# EAGLE design Blunderwood_LED_Driver (EAGLE 7.3.0)
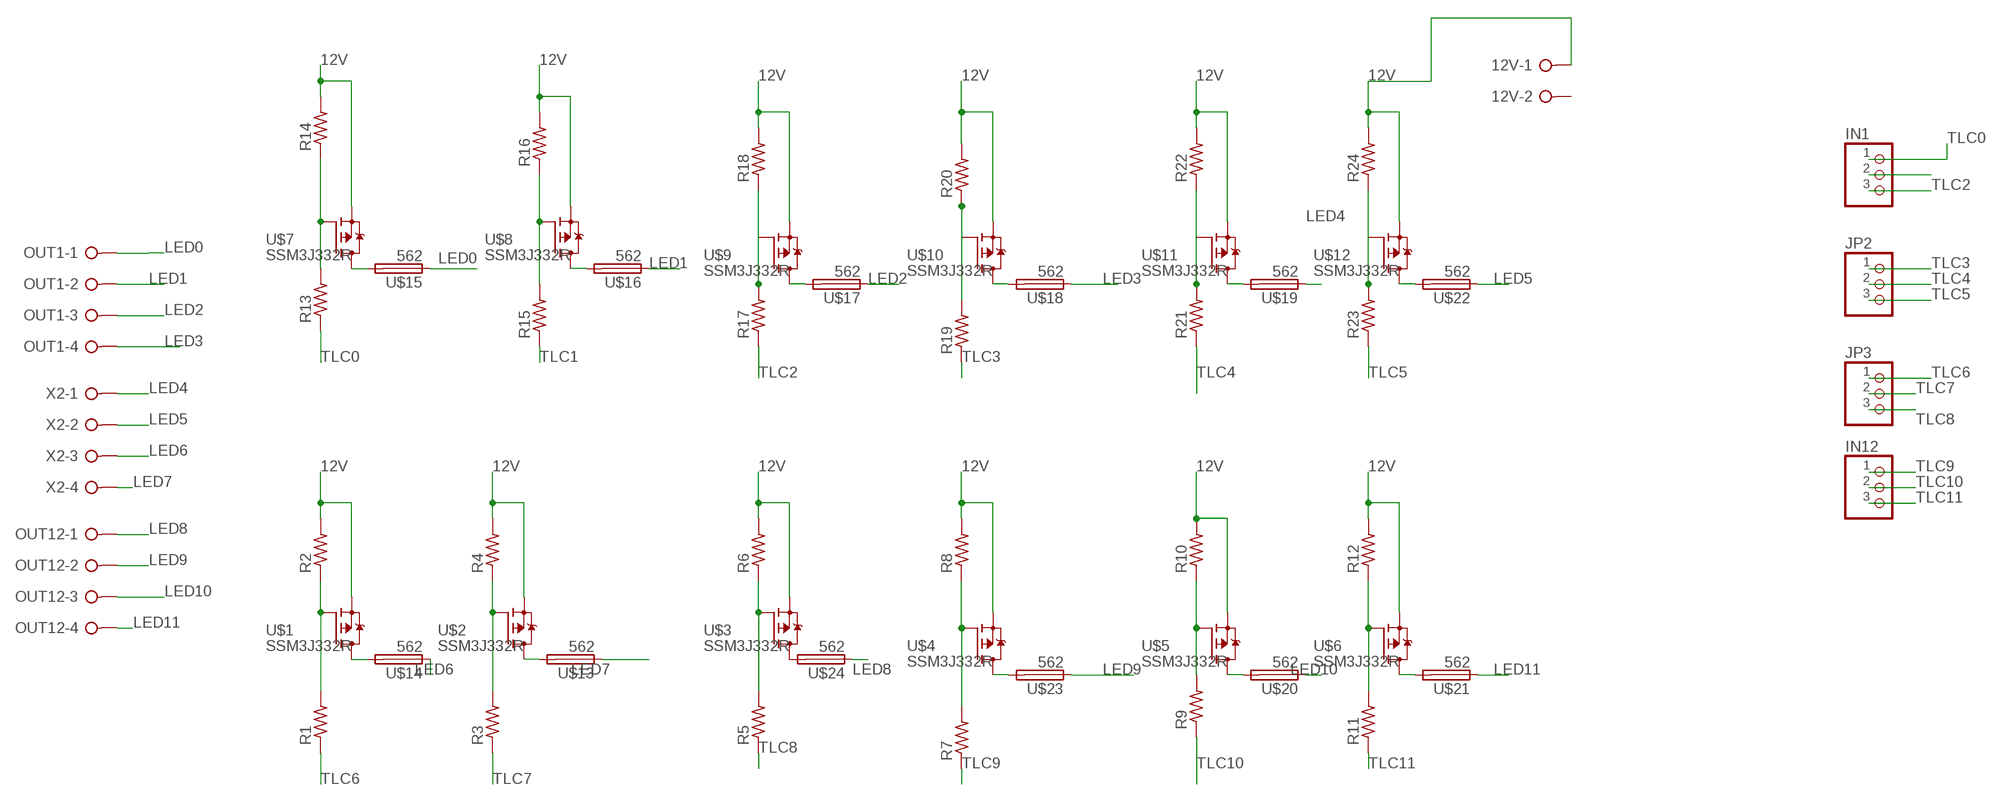
[diagram p0: schematic, sheet 1]

## Parts
12V  W237-02P  [W237-132]
IN1  PINHD-1X3  [1X03]
IN12  PINHD-1X3  [1X03]
JP2  PINHD-1X3  [1X03]
JP3  PINHD-1X3  [1X03]
OUT1  W237-04P  [W237-4P]
OUT12  W237-04P  [W237-4P]
R1  R-US_R0805  [R0805]
R2  R-US_R0805  [R0805]
R3  R-US_R0805  [R0805]
R4  R-US_R0805  [R0805]
R5  R-US_R0805  [R0805]
R6  R-US_R0805  [R0805]
R7  R-US_R0805  [R0805]
R8  R-US_R0805  [R0805]
R9  R-US_R0805  [R0805]
R10  R-US_R0805  [R0805]
R11  R-US_R0805  [R0805]
R12  R-US_R0805  [R0805]
R13  R-US_R0805  [R0805]
R14  R-US_R0805  [R0805]
R15  R-US_R0805  [R0805]
R16  R-US_R0805  [R0805]
R17  R-US_R0805  [R0805]
R18  R-US_R0805  [R0805]
R19  R-US_R0805  [R0805]
R20  R-US_R0805  [R0805]
R21  R-US_R0805  [R0805]
R22  R-US_R0805  [R0805]
R23  R-US_R0805  [R0805]
R24  R-US_R0805  [R0805]
U$1  SSM3J332R  [SOT23]
U$2  SSM3J332R  [SOT23]
U$3  SSM3J332R  [SOT23]
U$4  SSM3J332R  [SOT23]
U$5  SSM3J332R  [SOT23]
U$6  SSM3J332R  [SOT23]
U$7  SSM3J332R  [SOT23]
U$8  SSM3J332R  [SOT23]
U$9  SSM3J332R  [SOT23]
U$10  SSM3J332R  [SOT23]
U$11  SSM3J332R  [SOT23]
U$12  SSM3J332R  [SOT23]
U$13  562  [564]
U$14  562  [564]
U$15  562  [564]
U$16  562  [564]
U$17  562  [564]
U$18  562  [564]
U$19  562  [564]
U$20  562  [564]
U$21  562  [564]
U$22  562  [564]
U$23  562  [564]
U$24  562  [564]
X2  W237-04P  [W237-4P]

## Nets
12V: 12V.1 R2.2 R4.2 R6.2 R8.2 R10.2 R12.2 R14.2 R16.2 R18.2 R20.2 R22.2 R24.2 U$1.2(S) U$2.2(S) U$3.2(S) U$4.2(S) U$5.2(S) U$6.2(S) U$7.2(S) U$8.2(S) U$9.2(S) U$10.2(S) U$11.2(S) U$12.2(S)
LED0: OUT1.1 U$15.P$3
LED1: OUT1.2 U$16.P$3
LED2: OUT1.3 U$17.P$3
LED3: OUT1.4 U$18.P$3
LED4: U$19.P$3 X2.1
LED5: U$22.P$3 X2.2
LED6: U$14.P$3 X2.3
LED7: U$13.P$3 X2.4
LED8: OUT12.1 U$24.P$3
LED9: OUT12.2 U$23.P$3
LED10: OUT12.3 U$20.P$3
LED11: OUT12.4 U$21.P$3
N$1: R1.2 R2.1 U$1.1(G)
N$2: U$1.3(D) U$14.P$4
N$3: R3.2 R4.1 U$2.1(G)
N$4: R5.2 R6.1 U$3.1(G)
N$5: R7.2 R8.1 U$4.1(G)
N$6: U$4.3(D) U$23.P$4
N$7: U$2.3(D) U$13.P$4
N$8: U$3.3(D) U$24.P$4
N$9: R13.2 R14.1 U$7.1(G)
N$10: U$7.3(D) U$15.P$4
N$11: R9.2 R10.1 U$5.1(G)
N$12: U$5.3(D) U$20.P$4
N$13: R11.2 R12.1 U$6.1(G)
N$14: U$6.3(D) U$21.P$4
N$15: R15.2 R16.1 U$8.1(G)
N$16: U$8.3(D) U$16.P$4
N$17: R17.2 R18.1 U$9.1(G)
N$18: R19.2 R20.1 U$10.1(G)
N$19: U$10.3(D) U$18.P$4
N$20: R21.2 R22.1 U$11.1(G)
N$21: R23.2 R24.1 U$12.1(G)
N$22: U$12.3(D) U$22.P$4
N$23: U$9.3(D) U$17.P$4
N$24: U$11.3(D) U$19.P$4
TLC0: IN1.1 R13.1
TLC1: IN1.2 R15.1
TLC2: IN1.3 R17.1
TLC3: JP2.1 R19.1
TLC4: JP2.2 R21.1
TLC5: JP2.3 R23.1
TLC6: JP3.1 R1.1
TLC7: JP3.2 R3.1
TLC8: JP3.3 R5.1
TLC9: IN12.1 R7.1
TLC10: IN12.2 R9.1
TLC11: IN12.3 R11.1
Unconnected: 12V.2

## Library data of the parts
12V = con-wago-508:W237-02P: WAGO SREW CLAMP; OC_FARNELL: unknown; OC_NEWARK: unknown
IN1 IN12 JP2 JP3 = pinhead:PINHD-1X3: PIN HEADER
OUT1 OUT12 X2 = con-wago-508:W237-04P: WAGO SREW CLAMP; OC_FARNELL: unknown; OC_NEWARK: unknown
R1-R24 = resistor:R-US_: RESISTOR, American symbol
U$1-U$12 = transistor-fet:SSM3J332R: TOSHIBA Field-Effect Transistor Silicon P-Channel MOS Type (U-MOSVI)
U$13-U$24 = fuse:562

## Board
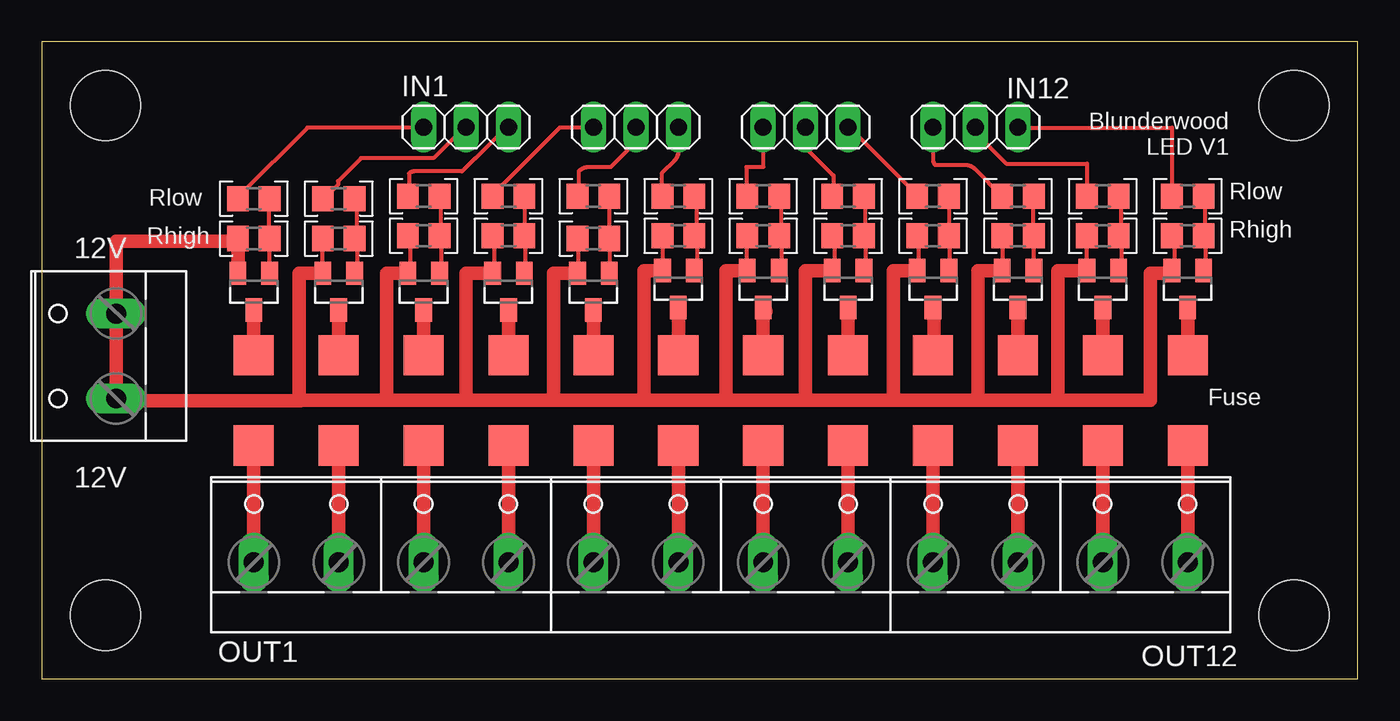
[diagram p1: board, top side]

Size 78.74 x 38.1 mm. Coordinates in mm from the lower left corner, seen from the top.
Outline: 0,0 78.74,0 78.74,38.1 0,38.1 0,0
Copper layers (1*16): Top 0.035mm / dielectric 1.5mm / Bottom 0.035mm
Design rules "hackvana": minimum track width 6mil, minimum drill 0.3mm, track to track 6mil, track to pad 6mil, pad to pad 6mil, via to via 6mil, smd to smd 0mil, copper to edge 6mil, drill to drill 6mil, minimum pad ring 10mil, minimum via ring 6mil, stop-mask expansion 2mil, vias tented up to drill 100mil, thermal gap 10mil
Holes 4.2 mm at 3.81,34.29 3.81,3.81 74.93,3.81 74.93,34.29

### Footprints (pad centres in the part's own frame; a part is rotated, then mirrored left to right if it is on the bottom)
W237-132 = drill 1.194 long: 1 -2.54,-0.635; 2 2.54,-0.635
1X03 = drill 1.016 long: 1 -2.54,0; 2 0,0; 3 2.54,0
W237-4P = drill 1.194 long: 1 -7.62,-0.635; 2 -2.54,-0.635; 3 2.54,-0.635; 4 7.62,-0.635
R0805 = smd 1.3 x 1.5: 1 -0.95,0; 2 0.95,0
SOT23 = smd 1 x 1.4: 1 -0.95,-1.1; 2 0.95,-1.1; 3 0,1.1
564 = smd 2.4 x 2.4: P$3 0,0; P$4 5.4,0

### Placement (x,y rotation side)
12V  3.81,19.3 90 top
IN1  25.39,33 0 top
IN12  55.87,33 0 top
JP2  35.55,33 0 top
JP3  45.71,33 0 top
OUT1  20.31,7.6 0 top
OUT12  60.95,7.6 0 top
R1  43.17,28.87 0 top
R2  43.17,26.49 180 top
R3  48.25,28.87 0 top
R4  48.25,26.49 180 top
R5  53.33,28.87 0 top
R6  53.33,26.49 180 top
R7  58.41,28.87 0 top
R8  58.41,26.49 180 top
R9  63.49,28.87 0 top
R10  63.49,26.49 180 top
R11  68.57,28.87 0 top
R12  68.57,26.49 180 top
R13  12.69,28.71 0 top
R14  12.69,26.33 180 top
R15  17.77,28.71 0 top
R16  17.77,26.33 180 top
R17  22.85,28.87 0 top
R18  22.85,26.49 180 top
R19  27.93,28.87 0 top
R20  27.93,26.49 180 top
R21  33.01,28.87 0 top
R22  33.01,26.33 180 top
R23  38.09,28.87 0 top
R24  38.09,26.49 180 top
U$1  43.17,23.32 180 top
U$2  48.25,23.32 180 top
U$3  53.33,23.32 180 top
U$4  58.41,23.32 180 top
U$5  63.49,23.32 180 top
U$6  68.57,23.32 180 top
U$7  12.69,23.16 180 top
U$8  17.77,23.16 180 top
U$9  22.85,23.16 180 top
U$10  27.93,23.16 180 top
U$11  33.01,23.16 180 top
U$12  38.09,23.32 180 top
U$13  48.25,13.95 90 top
U$14  43.17,13.95 90 top
U$15  12.69,13.95 90 top
U$16  17.77,13.95 90 top
U$17  22.85,13.95 90 top
U$18  27.93,13.95 90 top
U$19  33.01,13.95 90 top
U$20  63.49,13.95 90 top
U$21  68.57,13.95 90 top
U$22  38.09,13.95 90 top
U$23  58.41,13.95 90 top
U$24  53.33,13.95 90 top
X2  40.63,7.6 0 top

### Tracks (layer width: path | path; a pad name or v marks a point on that pad's centre or on a via)
12V
  Top 0.254: R16.2 16.82,26.11 16.82,24.51 U$8.2 | R18.2 22.07,26.34 22.07,24.51 U$9.2 | R20.2 27.1,26.34 27.1,24.51 U$10.2 | R22.2 32.13,26.11 32.13,24.51 U$11.2 | R24.2 37.16,26.34 37.16,24.74 U$12.2 | R2.2 42.19,26.34 42.19,24.74 U$1.2 | R4.2 47.45,26.34 47.45,24.74 U$2.2 | R6.2 52.48,26.34 52.48,24.74 U$3.2 | R8.2 57.51,26.34 57.51,24.74 U$4.2 | R10.2 62.53,26.34 62.53,24.74 U$5.2 | R12.2 67.79,26.34 67.79,24.74 U$6.2 | U$7.2 11.74,25.7 arc-45 11.92,26.15 11.94,26.16 11.94,26.29 4.88,26.29 arc45 4.57,26.16 4.57,17.07 arc-45 12V.1 | 15.39,24.26 15.39,16.9 arc45 15.49,16.64
  Top 0.813: U$7.2 R14.2 11.74,26.16 4.57,26.16 4.45,26.16 12V.1 arc45 4.75,16.64 15.49,16.64 | 20.62,16.65 15.39,16.65 15.39,24.26 U$8.2 | 20.62,16.65 25.39,16.65 | 25.39,16.65 30.63,16.65 | 30.63,16.65 36.02,16.65 | 36.02,16.65 40.95,16.65 | 40.95,16.65 45.71,16.65 | 45.71,16.65 50.95,16.65 | 50.95,16.65 56.03,16.65 | 56.03,16.65 60.79,16.65 | 60.79,16.65 66.34,16.65 66.34,24.27 67.62,24.27 U$6.2 | U$9.2 20.62,24.26 20.62,16.65 | U$10.2 25.39,24.26 25.39,16.65 | U$11.2 30.63,24.26 30.63,16.65 | U$12.2 36.02,24.42 36.02,16.65 | U$1.2 40.95,24.42 40.95,16.65 | U$2.2 45.71,24.42 45.71,16.65 | U$3.2 50.95,24.42 50.95,16.65 | U$4.2 56.03,24.42 56.03,16.65 | U$5.2 60.79,24.42 60.79,16.65
LED0
  Top 0.254: 12.7,13.77 U$15.P$3 | 12.7,7.14 OUT1.1
  Top 0.813: 12.7,7.14 12.69,7.14 U$15.P$3
LED1
  Top 0.254: 17.73,13.77 U$16.P$3 | 17.73,7.14 OUT1.2
  Top 0.813: 17.73,13.77 17.77,13.77 OUT1.2
LED2
  Top 0.254: 22.99,13.77 U$17.P$3 | 22.99,7.14 OUT1.3
  Top 0.813: 22.99,13.77 22.85,13.77 OUT1.3
LED3
  Top 0.254: 28.02,13.77 U$18.P$3 | 28.02,7.14 OUT1.4
  Top 0.813: 28.02,13.77 27.93,13.77 OUT1.4
LED4
  Top 0.254: 33.05,13.77 U$19.P$3 | 33.05,7.14 X2.1
  Top 0.813: 33.05,13.77 33.01,13.77 X2.1
LED5
  Top 0.254: 38.08,13.77 U$22.P$3 | 38.08,7.14 X2.2
  Top 0.813: 38.08,13.77 38.09,13.77 X2.2
LED6
  Top 0.254: 43.33,13.77 U$14.P$3 | 43.33,7.14 X2.3
  Top 0.813: 43.33,13.77 43.17,13.77 X2.3
LED7
  Top 0.254: 48.36,13.77 U$13.P$3 | 48.36,7.14 X2.4
  Top 0.813: 48.36,13.77 48.25,13.77 X2.4
LED8
  Top 0.254: 53.39,13.77 U$24.P$3 | 53.39,7.14 OUT12.1
  Top 0.813: 53.39,13.77 53.33,13.77 OUT12.1
LED9
  Top 0.254: 58.42,13.77 U$23.P$3 | 58.42,7.14 OUT12.2
  Top 0.813: 58.42,13.77 58.41,13.77 OUT12.2
LED10
  Top 0.254: 63.45,13.77 U$20.P$3 | 63.45,7.14 OUT12.3
  Top 0.813: 63.45,13.77 63.49,13.77 OUT12.3
LED11
  Top 0.254: 68.71,13.77 U$21.P$3 | 68.71,7.14 OUT12.4
  Top 0.813: 68.71,13.77 68.57,13.77 OUT12.4
N$1
  Top 0.254: U$1.1 44.25,24.51 44.25,26.34 R2.1 44.25,26.57 44.25,28.85 R1.2
N$2
  Top 0.254: 43.33,22 U$1.3 | 43.33,19.48 U$14.P$4
  Top 0.813: 43.33,22 43.17,22 U$14.P$4
N$3
  Top 0.254: U$2.1 49.28,24.51 49.28,26.34 R4.1 49.28,26.57 49.28,28.85 R3.2
N$4
  Top 0.254: U$3.1 54.3,24.51 54.3,26.34 R6.1 54.3,26.57 54.3,28.85 R5.2
N$5
  Top 0.254: U$4.1 59.33,24.51 59.33,26.34 R8.1 59.33,26.57 59.33,28.85 R7.2
N$6
  Top 0.254: 58.42,22 U$4.3 | 58.42,19.48 U$23.P$4
  Top 0.813: 58.42,19.48 58.41,19.48 U$4.3
N$7
  Top 0.254: 48.36,22 U$2.3 | 48.36,19.48 U$13.P$4
  Top 0.813: 48.36,22 48.25,22 U$13.P$4
N$8
  Top 0.254: 53.39,22 U$3.3 | 53.39,19.48 U$24.P$4
  Top 0.813: 53.39,19.48 53.39,22.15 U$3.3
N$9
  Top 0.254: U$7.1 13.61,24.28 13.61,26.11 R14.1 13.61,26.34 13.61,28.63 R13.2
N$10
  Top 0.254: 12.7,22 U$7.3 | 12.7,19.48 U$15.P$4
  Top 0.813: 12.7,22 12.69,22 U$15.P$4
N$11
  Top 0.254: U$5.1 64.59,24.51 64.59,26.34 R10.1 64.59,26.57 64.59,28.85 R9.2
N$12
  Top 0.254: 63.45,22 U$5.3 | 63.45,19.48 U$20.P$4
  Top 0.813: 63.45,19.48 63.49,19.48 U$5.3
N$13
  Top 0.254: U$6.1 69.62,24.51 69.62,26.34 R12.1 69.62,26.57 69.62,28.85 R11.2
N$14
  Top 0.254: 68.71,22 U$6.3 | 68.71,19.48 U$21.P$4
  Top 0.813: 68.71,19.48 68.57,19.48 U$6.3
N$15
  Top 0.254: U$8.1 18.87,24.28 18.87,26.11 R16.1 18.87,26.34 18.87,28.63 R15.2
N$16
  Top 0.254: 17.73,22 U$8.3 | 17.73,19.48 U$16.P$4
  Top 0.813: 17.73,19.48 17.77,19.48 U$8.3
N$17
  Top 0.254: U$9.1 23.9,24.28 23.9,26.34 R18.1 23.9,26.57 23.9,28.85 R17.2
N$18
  Top 0.254: U$10.1 28.93,24.28 28.93,26.34 R20.1 28.93,26.57 28.93,28.85 R19.2
N$19
  Top 0.254: 28.02,22 U$10.3 | 28.02,19.48 U$18.P$4
  Top 0.813: 28.02,19.48 27.93,19.48 U$10.3
N$20
  Top 0.254: U$11.1 33.96,24.28 33.96,26.11 R22.1 33.96,28.85 R21.2
N$21
  Top 0.254: U$12.1 39.22,24.51 39.22,26.34 R24.1 39.22,26.57 39.22,28.85 R23.2
N$22
  Top 0.254: 38.08,22 U$12.3 | 38.08,19.48 U$22.P$4
  Top 0.813: 38.08,19.48 38.09,19.48 U$12.3
N$23
  Top 0.254: 22.99,22 U$9.3 | 22.99,19.48 U$17.P$4
  Top 0.813: 22.99,19.48 22.85,19.48 U$9.3
N$24
  Top 0.254: 33.05,22 U$11.3 | 33.05,19.48 U$19.P$4
  Top 0.813: 33.05,22 33.01,22 U$19.P$4
TLC0
  Top 0.254: R13.1 11.79,28.85 15.9,32.97 22.76,32.97 IN1.1
TLC1
  Top 0.254: R15.1 17.04,28.85 17.73,29.54 17.73,29.77 19.1,31.14 23.44,31.14 25.27,32.97 IN1.2
TLC2
  Top 0.254: 22.07,29.08 R17.1 arc45 21.97,29.05 21.97,30.23 arc-45 22.28,30.35 25.15,30.35 25.91,31.12 arc-45 25.96,31.14 27.79,32.97 IN1.3
TLC3
  Top 0.254: R19.1 27.1,29.08 30.99,32.97 32.82,32.97 JP2.1
TLC4
  Top 0.254: JP2.2 35.55,32.45 arc-45 35.31,31.88 34.04,30.61 32.72,30.61 arc45 32.15,30.37 32.13,30.35 32.13,29.05 arc-45 R21.1
TLC5
  Top 0.254: JP2.3 38.09,31.57 arc-45 37.85,30.99 37.08,30.23 37.08,29 arc45 R23.1
TLC6
  Top 0.254: JP3.1 43.17,30.64 arc45 43.18,30.61 42.16,30.61 42.16,29 arc45 R1.1
TLC7
  Top 0.254: JP3.2 45.71,32.1 arc45 45.95,31.52 47.37,30.1 47.37,29.05 arc-45 R3.1
TLC8
  Top 0.254: R5.1 52.25,29.08 48.36,32.97 JP3.3
TLC9
  Top 0.254: IN12.1 53.33,31.07 arc45 53.47,30.73 55.26,30.73 arc-45 55.84,30.5 R7.1
TLC10
  Top 0.254: IN12.2 55.87,32.65 57.71,30.81 62.53,30.81 R9.1
TLC11
  Top 0.254: IN12.3 58.42,32.97 67.62,32.97 R11.1
  Top 0.406: R11.1 67.56,28.87

### Text on the board
tPlace: Rlow | Rlow | Rhigh | Rhigh | Fuse
tNames: Blunderwood / LED V1 | 12V